# Altium schematic sheet Supply.SchDoc
size A1
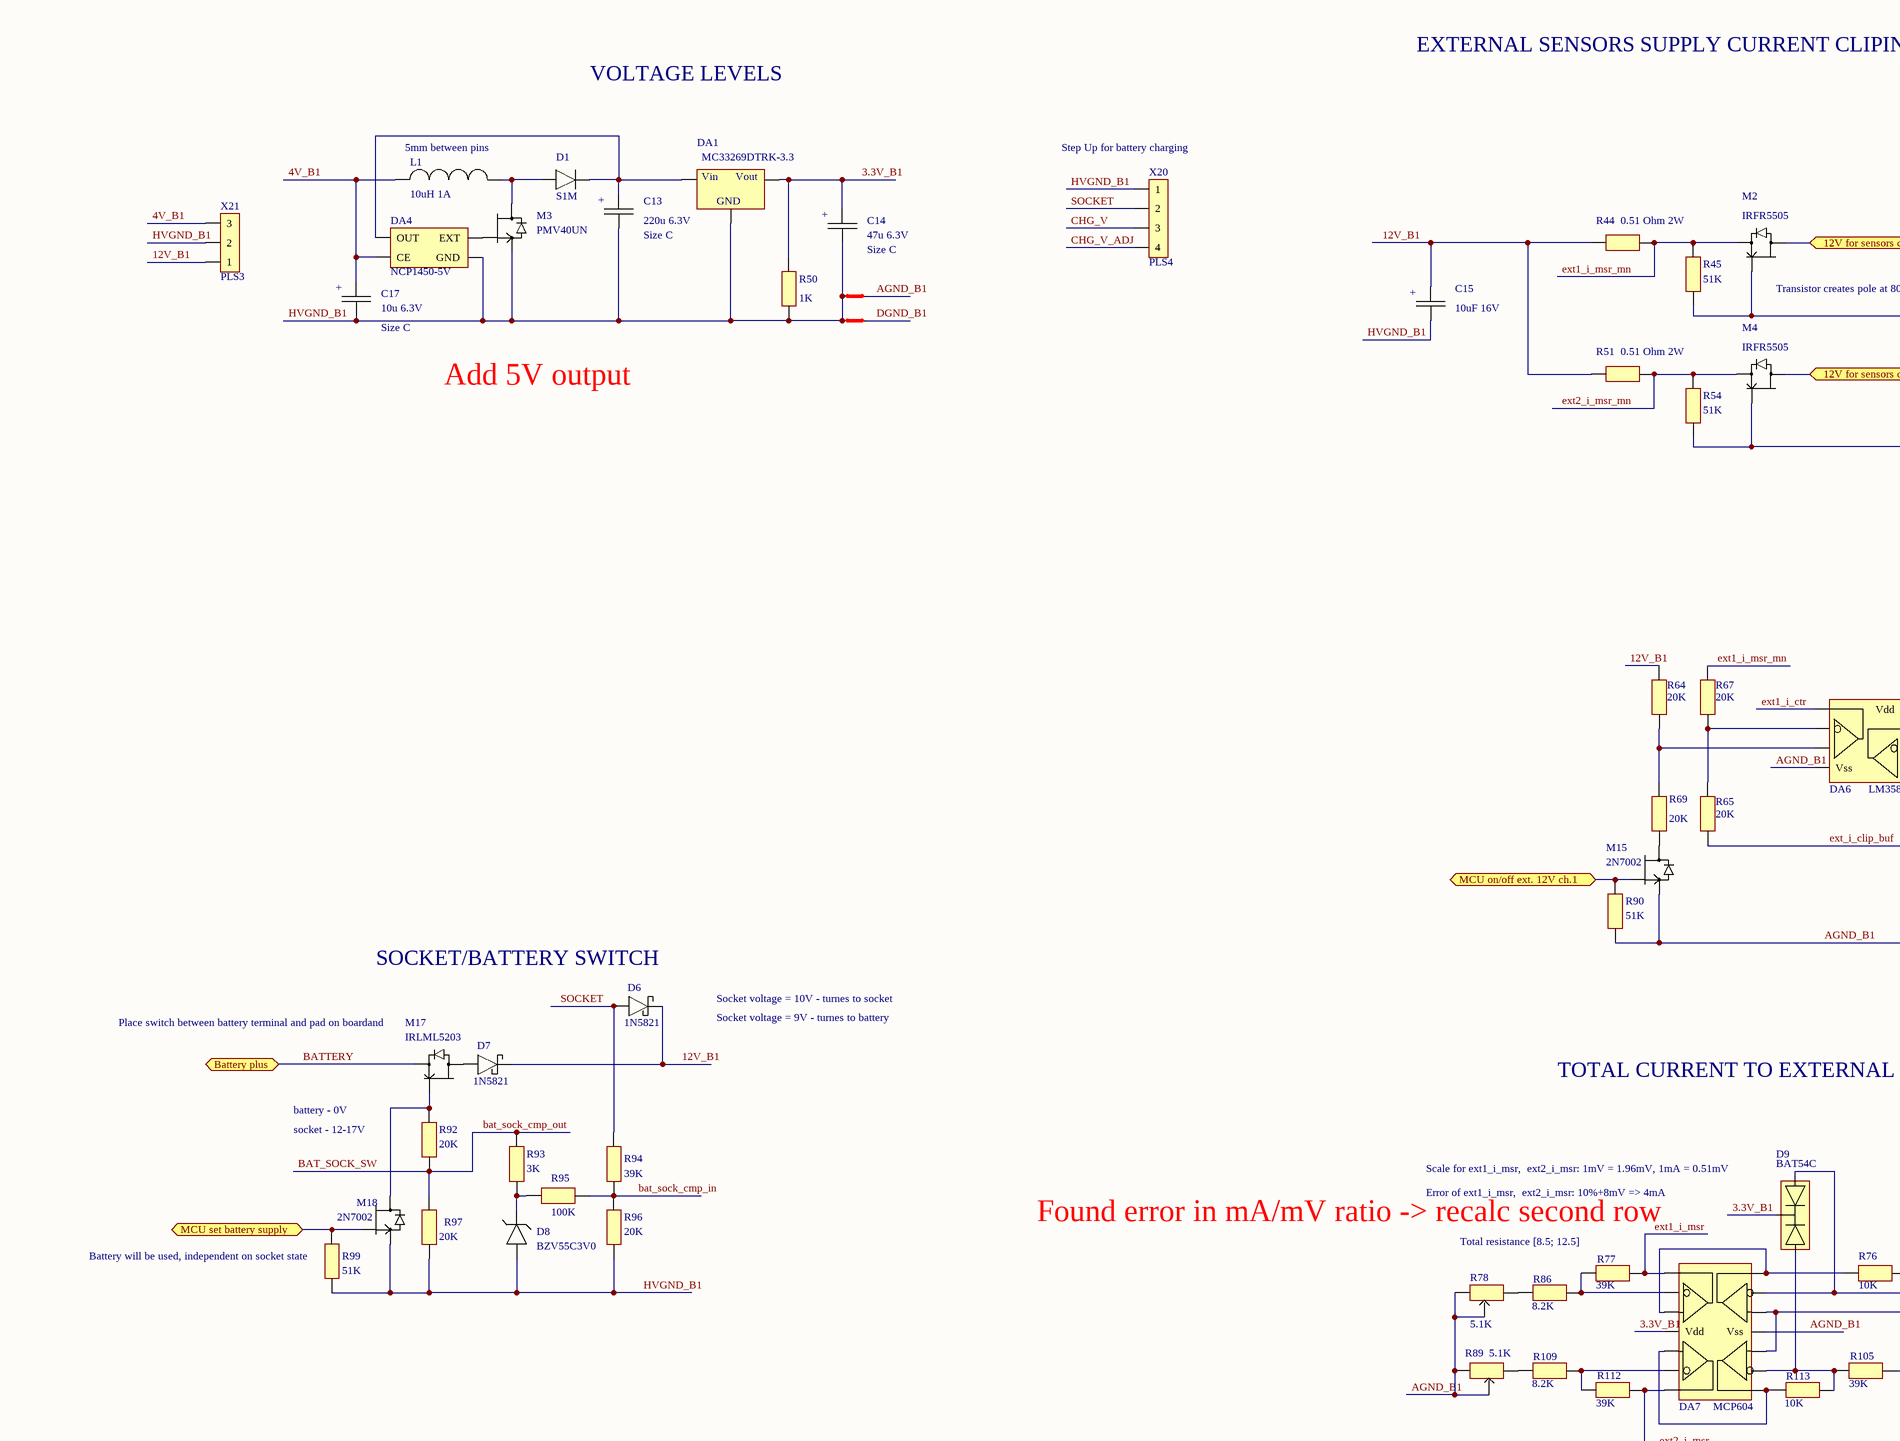
[diagram p0: Supply.SchDoc, top left]
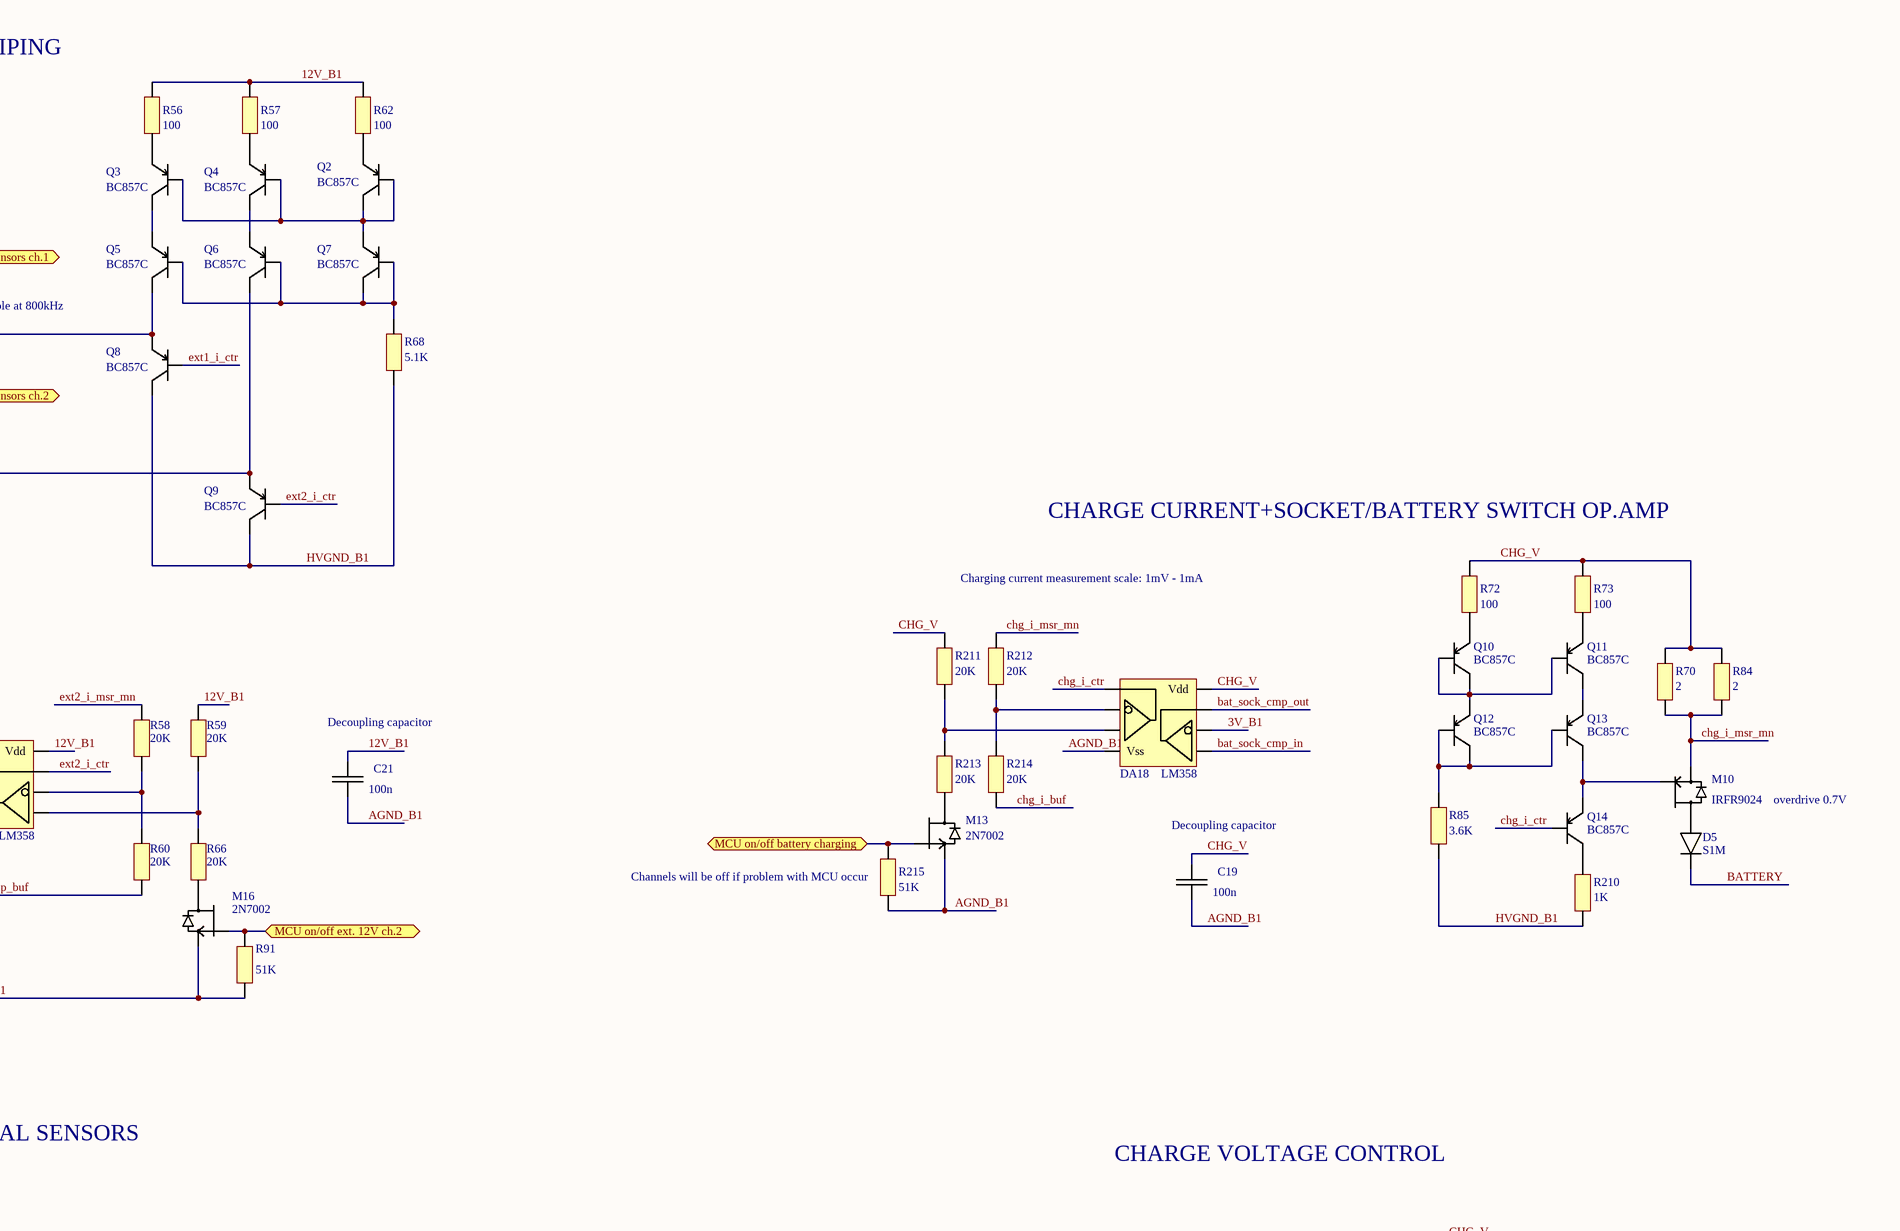
[diagram p1: Supply.SchDoc, top right]
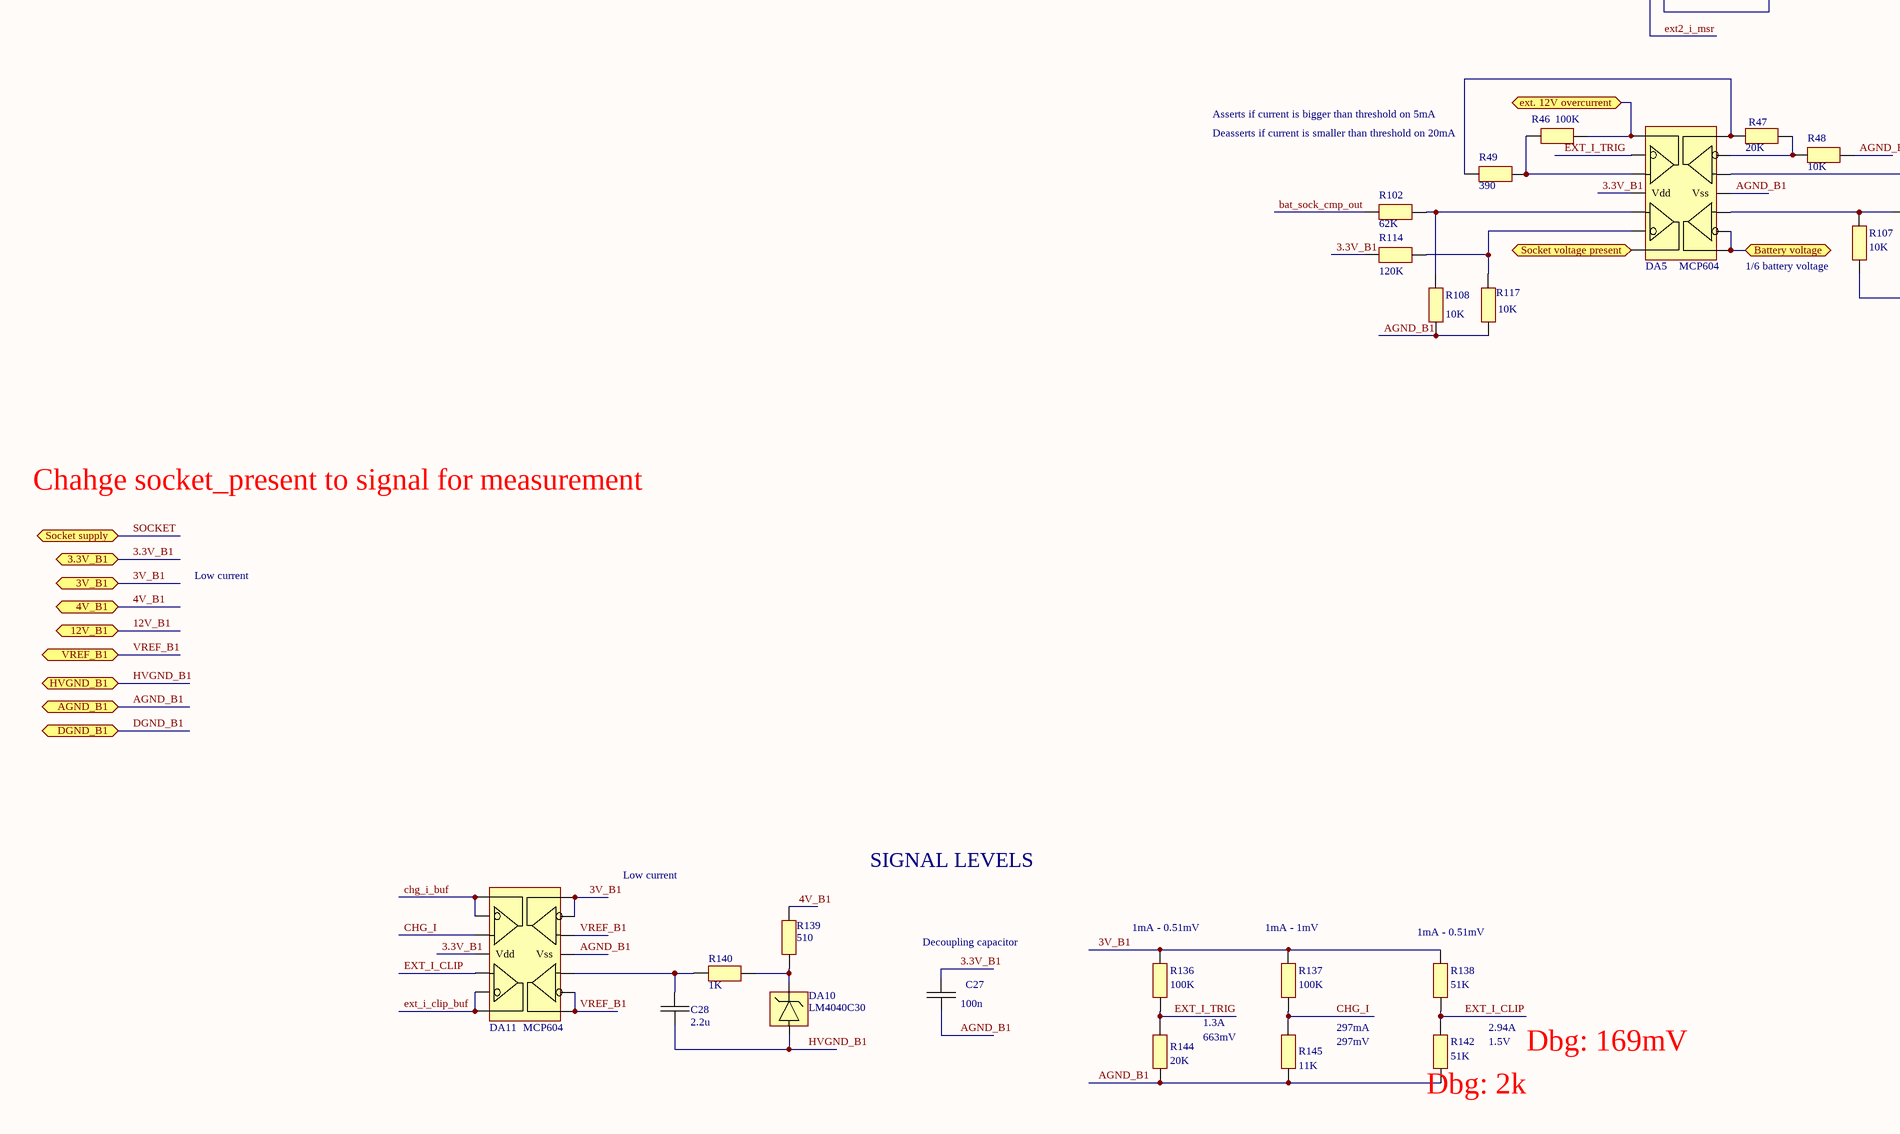
[diagram p2: Supply.SchDoc, bottom left]
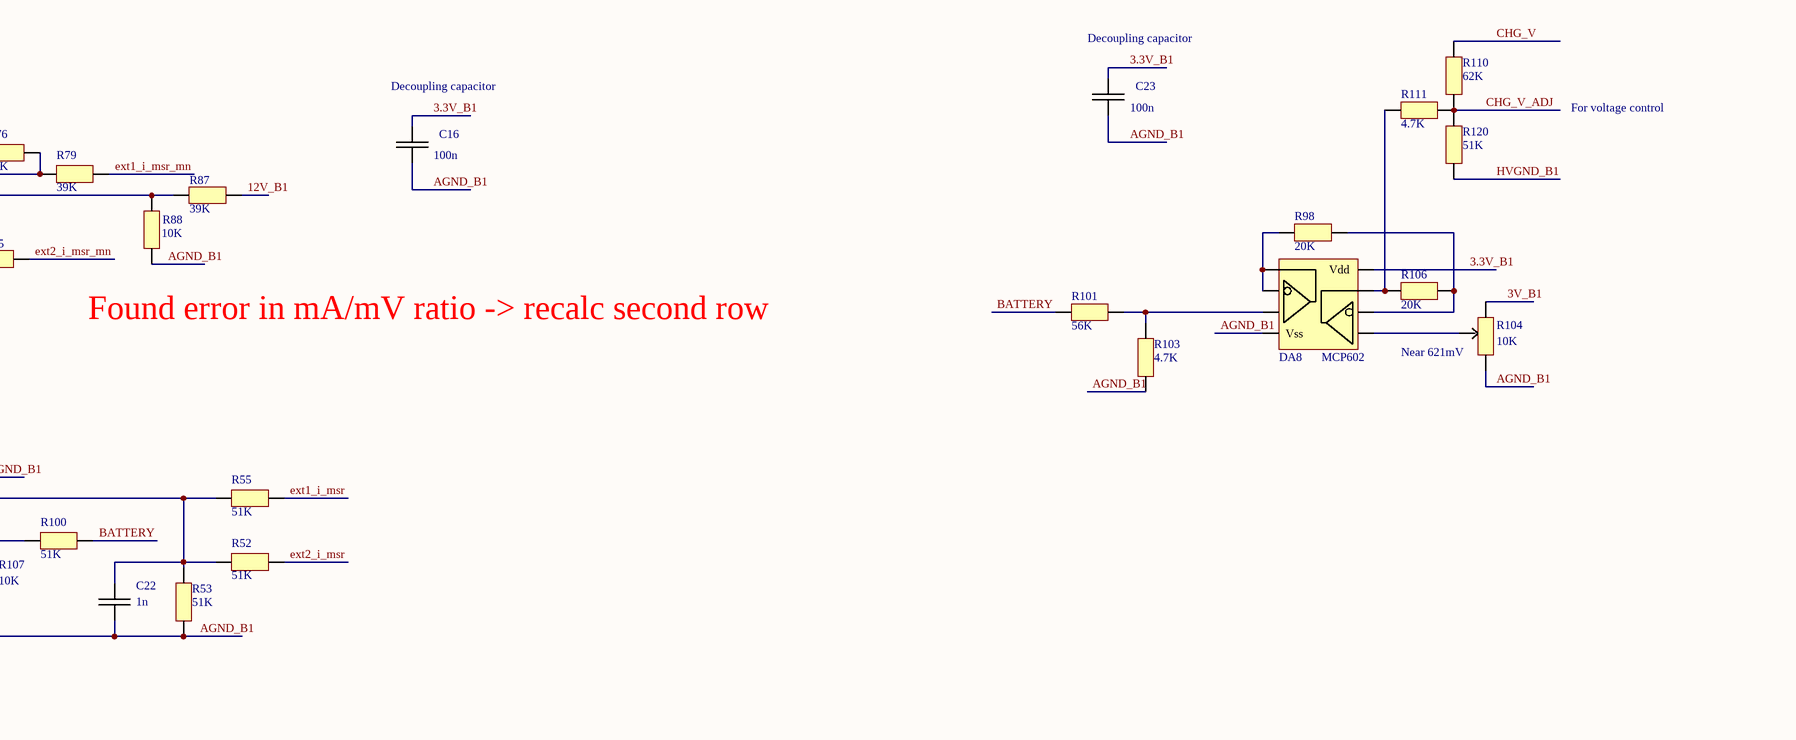
[diagram p3: Supply.SchDoc, bottom right]

## Parts
C13  220u 6.3V  [CALUM_SMD_C]
C14  47u 6.3V  [CALUM_SMD_C]
C15  10uF 16V  [CALUM_THT_E5D13]
C16  100n  [0805]
C17  10u 6.3V  [CALUM_SMD_C]
C19  100n  [0805]
C21  100n  [0805]
C22  1n  [0805]
C23  100n  [0805]
C27  100n  [0805]
C28  2.2u  [0805]
D1  S1M  [DO-214AC]
D5  S1M  [DO-214AC]
D6  1N5821  [DO-201AD]
D7  1N5821  [DO-201AD]
D8  BZV55C3V0  [SOD80]
D9  BAT54C  [SOT-23]
DA1  MC33269DTRK-3.3  [LINREG_DPAK]
DA4  NCP1450-5V  [TSSOP5]
DA5  MCP604  [SOP14]
DA6  LM358  [SOP8]
DA7  MCP604  [SOP14]
DA8  MCP602  [SOP8]
DA10  LM4040C30  [SOT-23]
DA11  MCP604  [SOP14]
DA18  LM358  [SOP8]
L1  10uH 1A  [INDUCTOR_5mm]
M2  IRFR5505  [TO-252(DPAK)]
M3  PMV40UN  [SOT-23]
M4  IRFR5505  [TO-252(DPAK)]
M10  IRFR9024  [TO-252(DPAK)]
M13  2N7002  [SOT-23]
M15  2N7002  [SOT-23]
M16  2N7002  [SOT-23]
M17  IRLML5203  [SOT-23]
M18  2N7002  [SOT-23]
N1  NetTie  [NET_TIE_1mm]  (value not drawn)  (net tie, no BOM)
N2  NetTie  [NET_TIE_1mm]  (value not drawn)  (net tie, no BOM)
Q2  BC857C  [SOT-23]
Q3  BC857C  [SOT-23]
Q4  BC857C  [SOT-23]
Q5  BC857C  [SOT-23]
Q6  BC857C  [SOT-23]
Q7  BC857C  [SOT-23]
Q8  BC857C  [SOT-23]
Q9  BC857C  [SOT-23]
Q10  BC857C  [SOT-23]
Q11  BC857C  [SOT-23]
Q12  BC857C  [SOT-23]
Q13  BC857C  [SOT-23]
Q14  BC857C  [SOT-23]
R44  0.51 Ohm 2W  [RES_2W]
R45  51K  [0805]
R46  100K  [0805]
R47  20K  [0805]
R48  10K  [0805]
R49  390  [0805]
R50  1K  [0805]
R51  0.51 Ohm 2W  [RES_2W]
R52  51K  [0805]
R53  51K  [0805]
R54  51K  [0805]
R55  51K  [0805]
R56  100  [0805]
R57  100  [0805]
R58  20K  [0805]
R59  20K  [0805]
R60  20K  [0805]
R62  100  [0805]
R64  20K  [0805]
R65  20K  [0805]
R66  20K  [0805]
R67  20K  [0805]
R68  5.1K  [0805]
R69  20K  [0805]
R70  2  [1206]
R72  100  [0805]
R73  100  [0805]
R76  10K  [0805]
R77  39K  [0805]
R78  5.1K  [3305SMD(adj res)]
R79  39K  [0805]
R84  2  [1206]
R85  3.6K  [0805]
R86  8.2K  [0805]
R87  39K  [0805]
R88  10K  [0805]
R89  5.1K  [3305SMD(adj res)]
R90  51K  [0805]
R91  51K  [0805]
R92  20K  [0805]
R93  3K  [0805]
R94  39K  [0805]
R95  100K  [0805]
R96  20K  [0805]
R97  20K  [0805]
R98  20K  [0805]
R99  51K  [0805]
R100  51K  [0805]
R101  56K  [0805]
R102  62K  [0805]
R103  4.7K  [0805]
R104  10K  [3296 X W(ADJ RES)]
R105  39K  [0805]
R106  20K  [0805]
R107  10K  [0805]
R108  10K  [0805]
R109  8.2K  [0805]
R110  62K  [0805]
R111  4.7K  [0805]
R112  39K  [0805]
R113  10K  [0805]
R114  120K  [0805]
R117  10K  [0805]
R120  51K  [0805]
R136  100K  [0805]
R137  100K  [0805]
R138  51K  [0805]
R139  510  [0805]
R140  1K  [0805]
R142  51K  [0805]
R144  20K  [0805]
R145  11K  [0805]
R210  1K  [0805]
R211  20K  [0805]
R212  20K  [0805]
R213  20K  [0805]
R214  20K  [0805]
R215  51K  [0805]
X20  PLS4  [PLS_4_BIG]
X21  PLS3  [PLS_3_BIG]

## Ports
3.3V_B1, 3V_B1, 4V_B1, 12V for sensors ch.1, 12V for sensors ch.2, 12V_B1, AGND_B1, Battery plus, Battery voltage, DGND_B1, ext. 12V overcurrent, HVGND_B1, MCU on/off battery charging, MCU on/off ext. 12V ch.1, MCU on/off ext. 12V ch.2, MCU set battery supply, Socket supply, Socket voltage present, VREF_B1

## Nets
3.3V_B1: C14.1 C16.2 C23.2 C27.2 D9.3(AK) DA1.out(Vout) DA5.4(Vdd) DA7.4(Vdd) DA8.8(Vdd) DA11.4(Vdd) R50.1 R114.2 ; port 3.3V_B1
3V_B1: DA11.13 DA11.14 DA18.6 R104.1 R136.1 R137.1 R138.1 ; port 3V_B1
4V_B1: C17.1 DA4.1(CE) L1.2 R139.1 X21.3 ; port 4V_B1
12V for sensors ch.1: M2.3 ; port 12V for sensors ch.1
12V for sensors ch.2: M4.3 ; port 12V for sensors ch.2
12V_B1: C15.1 C21.2 D6.2 D7.2 DA6.8(Vdd) R44.2 R51.2 R56.1 R57.1 R59.2 R62.1 R64.2 R87.1 X21.1 ; port 12V_B1
AGND_B1: C16.1 C19.1 C21.1 C22.1 C23.1 C27.1 DA5.11(Vss) DA6.4(Vss) DA7.11(Vss) DA8.4(Vss) DA11.11(Vss) DA18.4(Vss) M13.2 M15.2 M16.2 N1.2 R48.1 R53.1 R78.1 R78.3 R88.2 R89.2 R89.3 R90.2 R91.2 R103.2 R104.2 R107.1 R108.2 R117.2 R142.2 R144.2 R145.2 R215.2 ; port AGND_B1
bat_sock_cmp_in: DA18.5 R94.2 R95.2 R96.1
bat_sock_cmp_out: DA18.7 R92.2 R93.1 R97.1 R102.1  [also labelled BAT_SOCK_SW]
BATTERY: D5.2 M17.2 R100.2 R101.2 ; port Battery plus
Battery voltage: DA5.8 DA5.9 ; port Battery voltage
CHG_I: DA11.3 R137.2 R145.1
chg_i_buf: DA11.1 DA11.2 R214.2
chg_i_ctr: DA18.1 Q14.1(B)
chg_i_msr_mn: M10.2 R70.2 R84.2 R212.1
CHG_V: C19.2 DA18.8(Vdd) R70.1 R72.1 R73.1 R84.1 R110.1 R211.1 X20.3
CHG_V_ADJ: R110.2 R111.2 R120.1 X20.4
DGND_B1: N2.2 ; port DGND_B1
ext1_i_ctr: DA6.1 Q8.1(B)
ext1_i_msr: DA7.1 R55.1 R77.2
ext1_i_msr_mn: M2.2 R44.1 R45.1 R67.2 R79.1
ext2_i_ctr: DA6.7 Q9.1(B)
ext2_i_msr: DA7.7 R52.1 R112.2
ext2_i_msr_mn: M4.2 R51.1 R54.1 R58.2 R105.2
ext. 12V overcurrent: DA5.1 R46.1 ; port ext. 12V overcurrent
EXT_I_CLIP: DA11.5 R138.2 R142.1
ext_i_clip_buf: DA11.6 DA11.7 R60.2 R65.1
EXT_I_TRIG: DA5.2 R136.2 R144.1
HVGND_B1: C13.2 C14.2 C15.2 C17.2 C28.1 D8.1(A) DA1.gnd(GND) DA4.4(GND) DA10.2(A) M3.2 M18.2 N1.1 N2.1 Q8.3(C) Q9.3(C) R50.2 R68.2 R85.2 R96.2 R97.2 R99.2 R120.2 R210.2 X20.1 X21.2 ; port HVGND_B1
MCU on/off battery charging: M13.1 R215.1 ; port MCU on/off battery charging
MCU on/off ext. 12V ch.1: M15.1 R90.1 ; port MCU on/off ext. 12V ch.1
MCU on/off ext. 12V ch.2: M16.1 R91.1 ; port MCU on/off ext. 12V ch.2
MCU set battery supply: M18.1 R99.1 ; port MCU set battery supply
SOCKET: D6.1 R94.1 X20.2 ; port Socket supply
Socket voltage present: DA5.7 ; port Socket voltage present
VREF_B1: DA11.8 DA11.9 DA11.12 ; port VREF_B1
NetC13_1: C13.1 D1.2 DA1.in(Vin) DA4.2(OUT)
NetC22_2: C22.2 DA5.12 R52.2 R53.2 R55.2
NetC28_2: C28.2 DA11.10 R140.1
NetD1_1: D1.1 L1.1 M3.3
NetD5_1: D5.1 M10.3
NetD7_1: D7.1 M17.3
NetD8_2: D8.2(K) R93.2 R95.1
NetD9_1: D9.1(A1) DA7.13 R76.1 R79.2
NetD9_2: D9.2(K2) DA7.9 R105.1 R113.2
NetDA4_5: DA4.5(EXT) M3.1
NetDA5_3: DA5.3 R46.2 R49.1
NetDA5_5: DA5.5 R102.2 R108.1
NetDA5_6: DA5.6 R114.1 R117.1
NetDA5_10: DA5.10 R100.1 R107.2
NetDA5_13: DA5.13 R47.1 R48.2
NetDA5_14: DA5.14 R47.2 R49.2
NetDA6_2: DA6.2 R65.2 R67.1
NetDA6_3: DA6.3 R64.1 R69.1
NetDA6_5: DA6.5 R59.1 R66.1
NetDA6_6: DA6.6 R58.1 R60.1
NetDA7_2: DA7.2 R77.1 R86.2
NetDA7_3: DA7.3 DA7.14 R76.2
NetDA7_5: DA7.5 DA7.8 R113.1
NetDA7_6: DA7.6 R109.2 R112.1
NetDA7_10: DA7.10 DA7.12 R87.2 R88.1
NetDA8_1: DA8.1 DA8.2 R98.1
NetDA8_3: DA8.3 R101.1 R103.1
NetDA8_5: DA8.5 R104.3
NetDA8_6: DA8.6 R98.2 R106.2
NetDA8_7: DA8.7 R106.1 R111.1
NetDA10_1: DA10.1(K) R139.2 R140.2
NetDA18_2: DA18.2 R212.2 R214.1
NetDA18_3: DA18.3 R211.2 R213.1
NetM2_1: M2.1 Q5.3(C) Q8.2(E) R45.2
NetM4_1: M4.1 Q6.3(C) Q9.2(E) R54.2
NetM10_1: M10.1 Q13.3(C) Q14.2(E)
NetM13_3: M13.3 R213.2
NetM15_3: M15.3 R69.2
NetM16_3: M16.3 R66.2
NetM17_1: M17.1 M18.3 R92.1
NetQ2_1: Q2.1(B) Q2.3(C) Q3.1(B) Q4.1(B) Q7.2(E)
NetQ2_2: Q2.2(E) R62.2
NetQ3_2: Q3.2(E) R56.2
NetQ3_3: Q3.3(C) Q5.2(E)
NetQ4_2: Q4.2(E) R57.2
NetQ4_3: Q4.3(C) Q6.2(E)
NetQ5_1: Q5.1(B) Q6.1(B) Q7.1(B) Q7.3(C) R68.1
NetQ10_1: Q10.1(B) Q10.3(C) Q11.1(B) Q12.2(E)
NetQ10_2: Q10.2(E) R72.2
NetQ11_2: Q11.2(E) R73.2
NetQ11_3: Q11.3(C) Q13.2(E)
NetQ12_1: Q12.1(B) Q12.3(C) Q13.1(B) R85.1
NetQ14_3: Q14.3(C) R210.1
NetR78_2: R78.2 R86.1
NetR89_1: R89.1 R109.1

## Notes on the sheet
- EXTERNAL SENSORS SUPPLY CURRENT CLIPING
- VOLTAGE LEVELS
- (near L1) 5mm between pins
- (near X20) Step Up for battery charging
- Size C
- (near M2) Transistor creates pole at 800kHz
- (near C17) Size C
- Add 5V output
- CHARGE CURRENT+SOCKET/BATTERY SWITCH OP.AMP
- Charging current measurement scale: 1mV - 1mA
- (near C21) Decoupling capacitor
- Decoupling capacitor
- overdrive 0.7V
- (near R215) Channels will be off if problem with MCU occur
- (near D6) SOCKET/BATTERY SWITCH
- (near M17) Place switch between battery terminal and pad on boardand
- Socket voltage = 10V - turnes to socket
- Socket voltage = 9V - turnes to battery
- battery - 0V
- TOTAL CURRENT TO EXTERNAL SENSORS
- CHARGE VOLTAGE CONTROL
- socket - 12-17V
- (near D9) Scale for ext1_i_msr,  ext2_i_msr: 1mV = 1.96mV, 1mA = 0.51mV
- (near C23) Decoupling capacitor
- Found error in mA/mV ratio -> recalc second row
- Error of ext1_i_msr,  ext2_i_msr: 10%+8mV => 4mA
- (near C16) Decoupling capacitor
- For voltage control
- (near R99) Battery will be used, independent on socket state
- (near R77) Total resistance [8.5; 12.5]
- (near R88) Found error in mA/mV ratio -> recalc second row
- (near R104) Near 621mV
- Asserts if current is bigger than threshold on 5mA
- Deasserts if current is smaller than threshold on 20mA
- (near R107) 1/6 battery voltage
- Chahge socket_present to signal for measurement
- Low current
- (near DA11) Low current
- SIGNAL LEVELS
- (near C27) Decoupling capacitor
- (near R136) 1mA - 0.51mV
- (near R137) 1mA - 1mV
- (near R138) 1mA - 0.51mV
- 1.3A
- 663mV
- 297mA
- 2.94A
- 297mV
- (near R142) Dbg: 2k
- 1.5V
- Dbg: 169mV
- (in symbol C_POL) +

## Library data of the parts
C13-C15 C17 = C_POL
C16 C19 C21-C23 C27 C28 = C
D1 D5 = D
D6 D7 = D_Shottky
D8 = Zener diode
D9 = 2xD2
DA1 = LINEAR_REGULATOR
DA4 = ncp1450
DA5 DA7 DA11 = 4xOP.AMP
DA6 DA8 DA18 = 2xOP.AMP
DA10 = Shunt_VREF
L1 = Inductor
M2 M4 M10 M17 = PMOS+DIODE
M3 M13 M15 M16 M18 = NMOS+DIODE
Q2-Q14 = PNP
R44-R60 R62 R64-R70 R72 R73 R76 R77 R79 R84-R88 R90-R103 R105-R114 R117 R120 R136-R140 R142 R144 R145 R210-R215 = R
R78 R89 R104 = Radj
X20 = CONT_4
X21 = CONT_3